# Altium schematic sheet ESP32_S3.SchDoc
size A4; SheetNumber: 3; SheetTotal: 8
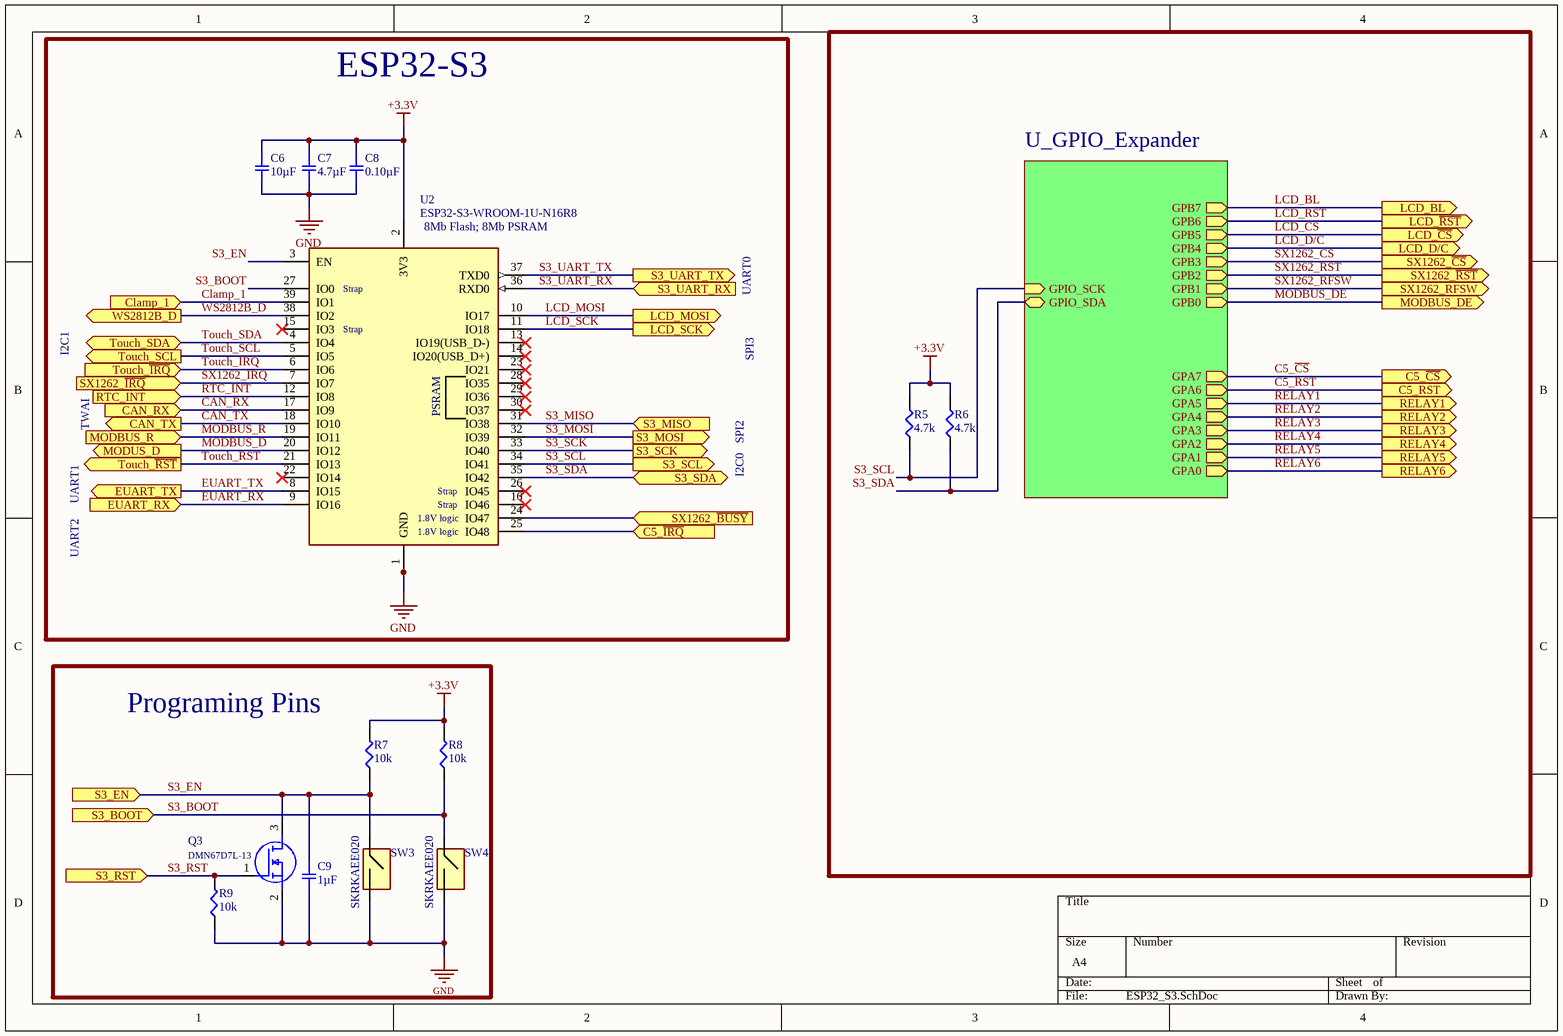
[diagram p0: ESP32_S3.SchDoc]

## Parts
C6  10µF  [SMD-0603C]
C7  4.7µF  [SMD-0402C]
C8  0.10µF  [SMD-0402C]
C9  1µF  [SMD-0402C]
Q3  DMN67D7L-13  [DMN67D7L13]
R5  4.7k  [SMD-0402-RES]
R6  4.7k  [SMD-0402-RES]
R7  10k  [SMD-0402-RES]
R8  10k  [SMD-0402-RES]
R9  10k  [SMD-0402-RES]
SW3  SKRKAEE020  [SKRKAEE020]
SW4  SKRKAEE020  [SKRKAEE020]
U2  ESP32-S3-WROOM-1U-N16R8  [ESP32S3WROOM1UN16R8]

## Blocks framed on the sheet
ESP32-S3: C6-C8 U2
Programing Pins: C9 Q3 R7-R9 SW3 SW4

## Sub-sheets
U_GPIO_Expander = GPIO_Expander.SchDoc: GPB7 (out), GPB6 (out), GPB5 (out), GPB4 (out), GPB3 (out), GPB2 (out), GPB1 (out), GPB0 (out), GPA0 (out), GPA1 (out), GPA2 (out), GPA3 (out), GPA4 (out), GPA5 (out), GPA6 (out), GPA7 (out), GPIO_SCK (in), GPIO_SDA (bidir)

## Ports
C5_RST (out), C5_~{CS} (out), C5_~{IRQ} (in), CAN_RX (in), CAN_TX (out), Clamp_1 (in), EUART_RX (in), EUART_TX (out), LCD_BL (out), LCD_D/C (out), LCD_MOSI (out), LCD_SCK (out), LCD_~{CS} (out), LCD_~{RST} (out), MODBUS_DE (out), MODBUS_R (in), MODUS_D (out), RELAY1 (out), RELAY2 (out), RELAY3 (out), RELAY4 (out), RELAY5 (out), RELAY6 (out), RTC_INT (in), S3_BOOT (in), S3_EN (in), S3_MISO (in), S3_MOSI (out), S3_RST (in), S3_SCK (out), S3_SCL (out), S3_SDA (bidir), S3_UART_RX (in), S3_UART_TX (out), SX1262_RFSW (out), SX1262_~{BUSY} (in), SX1262_~{CS} (out), SX1262_~{IRQ} (in), SX1262_~{RST} (out), Touch_SCL (out), Touch_SDA (bidir), Touch_~{IRQ} (in), Touch_~{RST} (out), WS2812B_D (out)

## Nets
+3.3V: C6.1 C7.1 C8.1 R5.2 R6.2 R7.2 R8.2 U2.2(3V3)
GND: C6.2 C7.2 C8.2 C9.2 Q3.2(S) R9.1 SW3.2 SW4.2 U2.1(GND) U2.40(GND) U2.41(GND) U2.42(GND) U2.43(GND) U2.44(GND) U2.45(GND) U2.46(GND) U2.47(GND) U2.48(GND) U2.49(GND)
C5_~{CS}: port C5_~{CS}, sheet U_GPIO_Expander/GPA7
C5_~{IRQ}: U2.25(IO48) ; port C5_~{IRQ}
C5_RST: port C5_RST, sheet U_GPIO_Expander/GPA6
CAN_RX: U2.17(IO9) ; port CAN_RX
CAN_TX: U2.18(IO10) ; port CAN_TX
Clamp_1: U2.39(IO1) ; port Clamp_1
EUART_RX: U2.9(IO16) ; port EUART_RX
EUART_TX: U2.8(IO15) ; port EUART_TX
LCD_BL: port LCD_BL, sheet U_GPIO_Expander/GPB7
LCD_~{CS}: port LCD_~{CS}, sheet U_GPIO_Expander/GPB5
LCD_D/C: port LCD_D/C, sheet U_GPIO_Expander/GPB4
LCD_MOSI: U2.10(IO17) ; port LCD_MOSI
LCD_~{RST}: port LCD_~{RST}, sheet U_GPIO_Expander/GPB6
LCD_SCK: U2.11(IO18) ; port LCD_SCK
MODBUS_D: U2.20(IO12) ; port MODUS_D
MODBUS_DE: port MODBUS_DE, sheet U_GPIO_Expander/GPB0
MODBUS_R: U2.19(IO11) ; port MODBUS_R
RELAY1: port RELAY1, sheet U_GPIO_Expander/GPA5
RELAY2: port RELAY2, sheet U_GPIO_Expander/GPA4
RELAY3: port RELAY3, sheet U_GPIO_Expander/GPA3
RELAY4: port RELAY4, sheet U_GPIO_Expander/GPA2
RELAY5: port RELAY5, sheet U_GPIO_Expander/GPA1
RELAY6: port RELAY6, sheet U_GPIO_Expander/GPA0
RTC_INT: U2.12(IO8) ; port RTC_INT
S3_BOOT: R8.1 SW4.1 U2.27(IO0) ; port S3_BOOT
S3_EN: C9.1 Q3.3(D) R7.1 SW3.1 U2.3(EN) ; port S3_EN
S3_MISO: U2.31(IO38) ; port S3_MISO
S3_MOSI: U2.32(IO39) ; port S3_MOSI
S3_RST: Q3.1(G) R9.2 ; port S3_RST
S3_SCK: U2.33(IO40) ; port S3_SCK
S3_SCL: R5.1 U2.34(IO41) ; port S3_SCL, sheet U_GPIO_Expander/GPIO_SCK
S3_SDA: R6.1 U2.35(IO42) ; port S3_SDA, sheet U_GPIO_Expander/GPIO_SDA
S3_UART_RX: U2.36(RXD0) ; port S3_UART_RX
S3_UART_TX: U2.37(TXD0) ; port S3_UART_TX
SX1262_~{BUSY}: U2.24(IO47) ; port SX1262_~{BUSY}
SX1262_~{CS}: port SX1262_~{CS}, sheet U_GPIO_Expander/GPB3
SX1262_~{IRQ}: U2.7(IO7) ; port SX1262_~{IRQ}
SX1262_~{RST}: port SX1262_~{RST}, sheet U_GPIO_Expander/GPB2
SX1262_RFSW: port SX1262_RFSW, sheet U_GPIO_Expander/GPB1
Touch_~{IRQ}: U2.6(IO6) ; port Touch_~{IRQ}
Touch_~{RST}: U2.21(IO13) ; port Touch_~{RST}
Touch_SCL: U2.5(IO5) ; port Touch_SCL
Touch_SDA: U2.4(IO4) ; port Touch_SDA
WS2812B_D: U2.38(IO2) ; port WS2812B_D

Not connected (* = marked no-connect by the designer): U2 13(IO19(USB_D-))* 14(IO20(USB_D+))* 15(IO3)* 16(IO46)* 22(IO14)* 23(IO21)* 26(IO45)* 28(IO35)* 29(IO36)* 30(IO37)*

## Notes on the sheet
- (near U2) 8Mb Flash; 8Mb PSRAM
- (near U2) Strap
- UART0
- I2C1
- SPI3
- TWAI
- SPI2
- UART1
- UART2
- (near U2) 1.8V logic
- I2C0
- (in symbol ESP32-S3-WROOM-1U-N16R8) PSRAM

## Library data of the parts
C6 = GRM185R60J106ME15D: CAP CER 10UF 6.3V X5R 0603; Manufacturer: Murata Electronics North America; Factory Stock: 0; Unit Price (USD): 0.36; Minimum Quantity: 1; Tolerance: ±20%; Datasheets: http://www.murata.com/~/media/webrenewal/support/library/catalog/products/capacitor/mlcc/c02e.pdf; Image: //media.digikey.com/Renders/Murata%20Renders/ZRB-SERIES-0402.jpg; Digi-Key Part Number: 490-10467-1-ND; Part Number: GRM185R60J106ME15D; Quantity Available: 25068; @ qty: 0; Packaging: Cut Tape (CT); Series: GRM; Part Status: Active; Value: 10µF; Voltage: 6.3V; Temperature Coefficient: X5R; Operating Temperature: -55°C ~ 85°C; Features: Derating Recommended; Ratings: -; Applications: General Purpose; Mounting Type: Surface Mount, MLCC; Package / Case: 0603 (1608 Metric); Size / Dimension: 0.063" L x 0.031" W (1.60mm x 0.80mm); Height - Seated (Max): -; Thickness (Max): 0.022" (0.55mm); Lead Spacing: -; Lead Style: -
C7 = GRM153R60J475ME15D: CAP CER 4.7UF 6.3V X5R 0402; Manufacturer: Murata Electronics North America; Factory Stock: 0; Unit Price (USD): 0.27; Minimum Quantity: 1; Tolerance: ±20%; Datasheets: http://psearch.en.murata.com/capacitor/product/GRM153R60J475ME15%23.pdf; Image: //media.digikey.com/Renders/Murata%20Renders/ZRB-SERIES-0402.jpg; Digi-Key Part Number: 490-13232-1-ND; Part Number: GRM153R60J475ME15D; Quantity Available: 30412; @ qty: 0; Packaging: Cut Tape (CT); Series: GRM; Part Status: Active; Value: 4.7µF; Voltage: 6.3V; Temperature Coefficient: X5R; Operating Temperature: -55°C ~ 85°C; Features: Derating Recommended; Ratings: -; Applications: General Purpose; Mounting Type: Surface Mount, MLCC; Package / Case: 0402 (1005 Metric); Size / Dimension: 0.039" L x 0.020" W (1.00mm x 0.50mm); Height - Seated (Max): -; Thickness (Max): 0.013" (0.33mm); Lead Spacing: -; Lead Style: -
C8 = GCM155R71C104KA55D: CAP CER 0.1UF 16V X7R 0402; Manufacturer: Murata Electronics North America; Factory Stock: 0; Unit Price (USD): 0.1; Minimum Quantity: 1; Tolerance: ±10%; Datasheets: http://www.murata.com/~/media/webrenewal/support/library/catalog/products/capacitor/mlcc/c03e.ashx; Image: //media.digikey.com/Renders/Murata%20Renders/ZRB-SERIES-0402.jpg; Digi-Key Part Number: 490-4759-1-ND; Part Number: GCM155R71C104KA55D; Quantity Available: 734194; @ qty: 0; Packaging: Cut Tape (CT); Series: GCM; Part Status: Active; Value: 0.10µF; Voltage: 16V; Temperature Coefficient: X7R; Operating Temperature: -55°C ~ 125°C; Features: -; Ratings: AEC-Q200; Applications: Automotive; Mounting Type: Surface Mount, MLCC; Package / Case: 0402 (1005 Metric); Size / Dimension: 0.039" L x 0.020" W (1.00mm x 0.50mm); Height - Seated (Max): -; Thickness (Max): 0.022" (0.55mm); Lead Spacing: -; Lead Style: -
C9 = GCM155C71A105KE38D: CAP CER 1UF 10V X7S 0402; Manufacturer: Murata Electronics North America; Factory Stock: 0; Unit Price (USD): 0.12; Minimum Quantity: 1; Tolerance: ±10%; Datasheets: http://www.murata.com/~/media/webrenewal/support/library/catalog/products/capacitor/mlcc/c03e.ashx; Image: //media.digikey.com/Renders/Murata%20Renders/ZRB-SERIES-0402.jpg; Digi-Key Part Number: 490-13409-1-ND; Part Number: GCM155C71A105KE38D; Quantity Available: 7240; @ qty: 0; Packaging: Cut Tape (CT); Series: GCM; Part Status: Active; Value: 1µF; Voltage: 10V; Temperature Coefficient: X7S; Operating Temperature: -55°C ~ 125°C; Features: -; Ratings: AEC-Q200; Applications: Automotive; Mounting Type: Surface Mount, MLCC; Package / Case: 0402 (1005 Metric); Size / Dimension: 0.039" L x 0.020" W (1.00mm x 0.50mm); Height - Seated (Max): -; Thickness (Max): 0.022" (0.55mm); Lead Spacing: -; Lead Style: -
Q3 = DMN67D7L-13: MOSFET (N-Channel); Manufacturer_Name: Diodes Incorporated; Datasheet Link: https://www.diodes.com/assets/Package-Files/SOT23.pdf; Height: 1.1mm; Manufacturer_Part_Number: DMN67D7L-13; Mouser Part Number: 621-DMN67D7L-13; Mouser Price/Stock: https://www.mouser.co.uk/ProductDetail/Diodes-Incorporated/DMN67D7L-13?qs=W0yvOO0ixfHR5TrLcSFuNw%3D%3D; Arrow Part Number: DMN67D7L-13; Arrow Price/Stock: https://www.arrow.com/en/products/dmn67d7l-13/diodes-incorporated?region=nac; Value: DMN67D7L-13
R5 R6 = ERJ-2RKF4701X: RES SMD 4.7K OHM 1% 1/10W 0402; Manufacturer: Panasonic Electronic Components; Factory Stock: 0; Unit Price (USD): 0.00496; @ qty: 1500; Minimum Quantity: 1; Power (Watts): 0.1W, 1/10W; Temperature Coefficient: ±100ppm/°C; Part Number: ERJ-2RKF4701X; Datasheets: http://industrial.panasonic.com/www-cgi/jvcr13pz.cgi?E+PZ+3+AOA0002+ERJ2RKF4701X+7+WW; Image: //media.digikey.com/Photos/Panasonic%20Photos/ERJ-PA2-Series.jpg; Digi-Key Part Number: P4.70KLCT-ND; Quantity Available: 1881807; Packaging: Cut Tape (CT); Series: ERJ; Part Status: Active; Value: 4.7k; Tolerance: ±1%; Composition: Thick Film; Features: Automotive AEC-Q200; Operating Temperature: -55°C ~ 155°C; Package / Case: 0402 (1005 Metric); Supplier Device Package: 0402; Size / Dimension: 0.039" L x 0.020" W (1.00mm x 0.50mm); Height - Seated (Max): 0.016" (0.40mm); Number of Terminations: 2; Failure Rate: -
R7-R9 = ERJ-2RKF1002X: RES SMD 10K OHM 1% 1/10W 0402; Manufacturer: Panasonic Electronic Components; Factory Stock: 0; Unit Price (USD): 0.00496; @ qty: 1500; Minimum Quantity: 1; Power (Watts): 0.1W, 1/10W; Temperature Coefficient: ±100ppm/°C; Part Number: ERJ-2RKF1002X; Datasheets: http://industrial.panasonic.com/www-cgi/jvcr13pz.cgi?E+PZ+3+AOA0002+ERJ2RKF1002X+7+WW; Image: //media.digikey.com/Photos/Panasonic%20Photos/ERJ-PA2-Series.jpg; Digi-Key Part Number: P10.0KLCT-ND; Quantity Available: 9922786; Packaging: Cut Tape (CT); Series: ERJ; Part Status: Active; Value: 10k; Tolerance: ±1%; Composition: Thick Film; Features: Automotive AEC-Q200; Operating Temperature: -55°C ~ 155°C; Package / Case: 0402 (1005 Metric); Supplier Device Package: 0402; Size / Dimension: 0.039" L x 0.020" W (1.00mm x 0.50mm); Height - Seated (Max): 0.016" (0.40mm); Number of Terminations: 2; Failure Rate: -
SW3 SW4 = SKRKAEE020: Tactile Switches 3.9x2.9x2.0mm 160gf Packaging Temp 80oC; Manufacturer_Name: ALPS Electric; Datasheet Link: http://www.alps.com/prod/info/J/HTML/Tact/SurfaceMount/SKRK/SKRKAEE020.html; Height: 2mm; Manufacturer_Part_Number: SKRKAEE020; Mouser Part Number: 688-SKRKAEE020; Mouser Price/Stock: https://www.mouser.co.uk/ProductDetail/Alps-Alpine/SKRKAEE020?qs=MrosSN5%252BUQW89XjXIp8Ugw%3D%3D; Value: SKRKAEE020
U2 = ESP32-S3-WROOM-1U-N16R8: RF System on a Chip - SoC SMD IC ESP32-S3, dual-core MCU, Wi-Fi 2.4G & BLE 5.0 combo, QFN 56-pin, 7*7 mm; Manufacturer_Name: Espressif Systems; Datasheet Link: https://www.espressif.com/sites/default/files/documentation/esp32-s3-wroom-1_wroom-1u_datasheet_en.pdf; Height: 3.35mm; Manufacturer_Part_Number: ESP32-S3-WROOM-1U-N16R8; Mouser Part Number: 356-ESP32S3WM1UN16R8; Mouser Price/Stock: https://www.mouser.co.uk/ProductDetail/Espressif-Systems/ESP32-S3-WROOM-1U-N16R8?qs=Li%252BoUPsLEns6V0Pr5KRJtw%3D%3D; Value: ESP32-S3-WROOM-1U-N16R8